# Altium schematic sheet InstrumentalAmplifier+in.SchDoc
size A; SheetNumber: 1; SheetTotal: 5
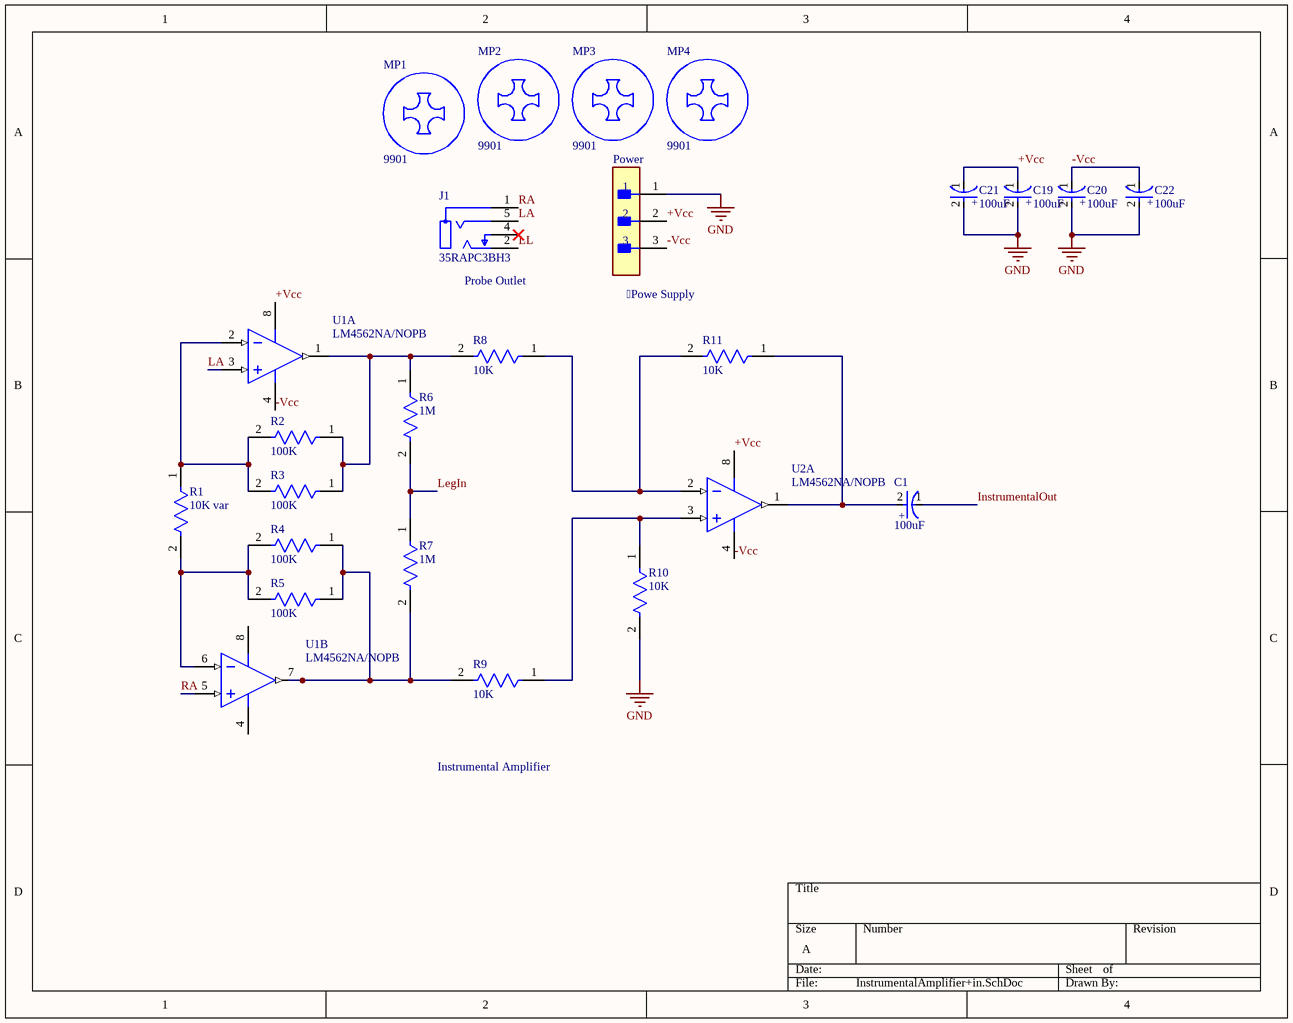
[diagram p0: InstrumentalAmplifier+in.SchDoc]

## Parts
C1  100uF  [FP-RAD-TH-D_6_3_0_5-L_11-MFG]
C19  100uF  [FP-RAD-TH-D_6_3_0_5-L_11-MFG]
C20  100uF  [FP-RAD-TH-D_6_3_0_5-L_11-MFG]
C21  100uF  [FP-RAD-TH-D_6_3_0_5-L_11-MFG]
C22  100uF  [FP-RAD-TH-D_6_3_0_5-L_11-MFG]
J1  35RAPC3BH3  [FP-35RAPC3BH3-MFG]
MP1  9901  [FP-9901-MFG]
MP2  9901  [FP-9901-MFG]
MP3  9901  [FP-9901-MFG]
MP4  9901  [FP-9901-MFG]
Power  87224-3  [FP-87224-3-MFG]  (value not drawn)
R1  10K var  [FP-CFR-25-MFG]
R2  100K  [FP-CFR-25-MFG]
R3  100K  [FP-CFR-25-MFG]
R4  100K  [FP-CFR-25-MFG]
R5  100K  [FP-CFR-25-MFG]
R6  1M  [FP-CFR-25-MFG]
R7  1M  [FP-CFR-25-MFG]
R8  10K  [FP-CFR-25-MFG]
R9  10K  [FP-CFR-25-MFG]
R10  10K  [FP-CFR-25-MFG]
R11  10K  [FP-CFR-25-MFG]
U1  LM4562NA/NOPB  [P0008A]  (parts A,B of 2)
U2  LM4562NA/NOPB  [P0008A]  (part A of 2)

## Nets
GND: C19.2(A) C20.2(A) C21.2(A) C22.2(A) Power.1 R10.2
+Vcc: C19.1(C) C21.1(C) Power.2 U1.8(V+) U2.8(V+)
-Vcc: C20.1(C) C22.1(C) Power.3 U1.4(V-) U2.4(V-)
InstrumentalOut: C1.1(C)
LA: J1.5 U1.3(IN_A)
LegIn: R6.2 R7.1
LL: J1.2
RA: J1.1 U1.5(IN_B)
NetC1_2: C1.2(A) R11.1 U2.1(OUT_A)
NetR1_1: R1.1 R2.2 R3.2 U1.2(IN_A)
NetR1_2: R1.2 R4.2 R5.2 U1.6(IN_B)
NetR2_1: R2.1 R3.1 R6.1 R8.2 U1.1(OUT_A)
NetR4_1: R4.1 R5.1 R7.2 R9.2 U1.7(OUT_B)
NetR8_1: R8.1 R11.2 U2.2(IN_A)
NetR9_1: R9.1 R10.1 U2.3(IN_A)

Not connected (* = marked no-connect by the designer): J1 4*

## Notes on the sheet
- (near J1) Probe Outlet
- Powe Supply
- Instrumental Amplifier
- (in symbol CMP-05427-000237-1) +

## Library data of the parts
C1 C19-C22 = CMP-05427-000237-1: Aluminum Electrolytic Capacitors (Radial Lead Type) 4.7uF ±20% 160V; Life (Hours): 2000Hour; Ripple Current: 43mA; Dielectric Material: Aluminium; Lead/Base Style: Straight; Lead Diameter: 0.5mm; Dissipation Factor: 0.15%; Height - Seated (Max): 0.48inch; Voltage: 160V; REACH SVHC: No SVHC; Package Quantity: 200; Length: 11.2mm; Termination: Radial; Weight: 0.01lb; Construction: RADIAL; Voltage Rating (DC): 160V; Number of Pins: 2; Voltage Rating: 160V; Min Operating Temperature: -25°C; Packaging: Bulk; Radiation Hardening: No; Series: NHG; Max Operating Temperature: 105°C; Height: 11.2mm; Mount: Through Hole; Tolerance: 20%; Capacitance: 4.7uF; Width: 0.25inch; Lead Pitch: 2.5mm; Diameter: 6.3mm; Ripple Current (AC): 43mA; Case/Package: Radial; Lead Free: Lead Free; RoHS Compliant: Yes
J1 = CMP-47983-000003-1: CONN JACK STEREO 3.5MM R/A; Gender: Female; Number of Positions: 3; Body Color: Black; Number of Ports: 1; Voltage Rating: 500V; Shielding: Unshielded; Body Material: Brass; Orientation: Right Angle; RoHS Compliant: Yes; Termination: Solder; Lead Free: Lead Free; Package Quantity: 1; Series: 35; Housing Material: PBT; Color: Black; Packaging: Bulk; Contact Plating: Silver; Mount: Through Hole; Contact Material: Copper Alloy; Number of Terminals/Pins: 3
MP1-MP4 = CMP-19664-000002-1: MACHINE SCREW PAN PHILLIPS 4-40; Head Height: 0.065inch; Thread Size: #4-40; Outside Diameter: 0.212inch; Material: Stainless Steel; Lead Free: Lead Free; Series: -; Package Quantity: 100; Length: 0.44inch; Mount: Screw
Power = CMP-2000-05697-2: CONN HEADER VERT 3POS 2.54MM; Number of Positions: 3; Gasket: No (Without); High Speed Serial Data Connector: No; Current Rating: 3A; Contact Post Length: 0.125inch; PCB Thickness: 1.397mm; PCB Mount Retention: Without; Connector Type: Plug; Approvals: CSA; PCB Mounting Orientation: Vertical; Pitch: 2.54mm; Mating Alignment: No (Without); Housing Color: Black; Contact Gender: Male; Length: 7.21mm; Max Operating Temperature: 105°C; Strain Relief: No (Without); Contact Material: Bronze; Row Spacing: 2.54mm; Series: AMPMODU MOD II; Board Standoff: No (Without); Package Quantity: 520; Radiation Hardening: No; Contact Protection: No (Without); Stabilizers: No (Without); Number of Rows: 1; Contact Mating Length: 8.08mm; Contact Shape: Square; Depth: 2.54mm; Contact Current Rating: 3A; Flammability Rating: UL94 V-0; Packaging: Carton; Number of Contacts: 3; Orientation: Straight; Mount: Through Hole; Keyed: No; Contact Type: Male Pin; Housing Material: Thermoplastic; High Temperature Housing: No; ELV: Compliant; Contact Plating: Gold; Termination: Through Hole; Selectively Loaded: No (Without); Lead Free: Lead Free; Min Operating Temperature: -65°C; Mating Connector Lock: No (Without); Color: Black; RoHS Compliant: Yes
R1-R11 = CMP-03413-000009-1: RES 10 OHM 1/4W 5% AXIAL; Resistance: 10R; Temperature Coefficient: 500ppm/°C; Max Power Dissipation: 250mW; RoHS Compliant: Yes; Packaging: Bulk; Series: Carbon Film; Case/Package: Axial; Max Operating Temperature: 155°C; Min Operating Temperature: -55°C; Number of Terminations: 2; Length: 0.248inch; Resistor Type: Carbon Film; Tolerance: 5%; Package Quantity: 200
U1 U2 = CMP-0057-00042-3: Dual High Performance, High Fidelity Audio Operational Amplifier, 8-pin MDIP, Pb-Free; Manufacturer: Texas Instruments; PackageTopMarking: NSUZXYTTE#*LM*4562NA; PowerWise: Y; CompType: Audio IC; RoHS: Y; ComponentLink1Description: Datasheet URL; Code_JEDEC: MS-001-BA; PackageDescription: MDIP, .365 x .250 x .130in, 8 Lead, .100in Pitch; ComponentLink1URL: http://www.ti.com/general/docs/lit/getliterature.tsp?genericPartNumber=LM4562&fileType=pdf; PackageReference: P0008A; PinCount: 8